# EAGLE schematic OSSI-1 OBC (EAGLE 6.5.0)

## Sheet 1 of 4
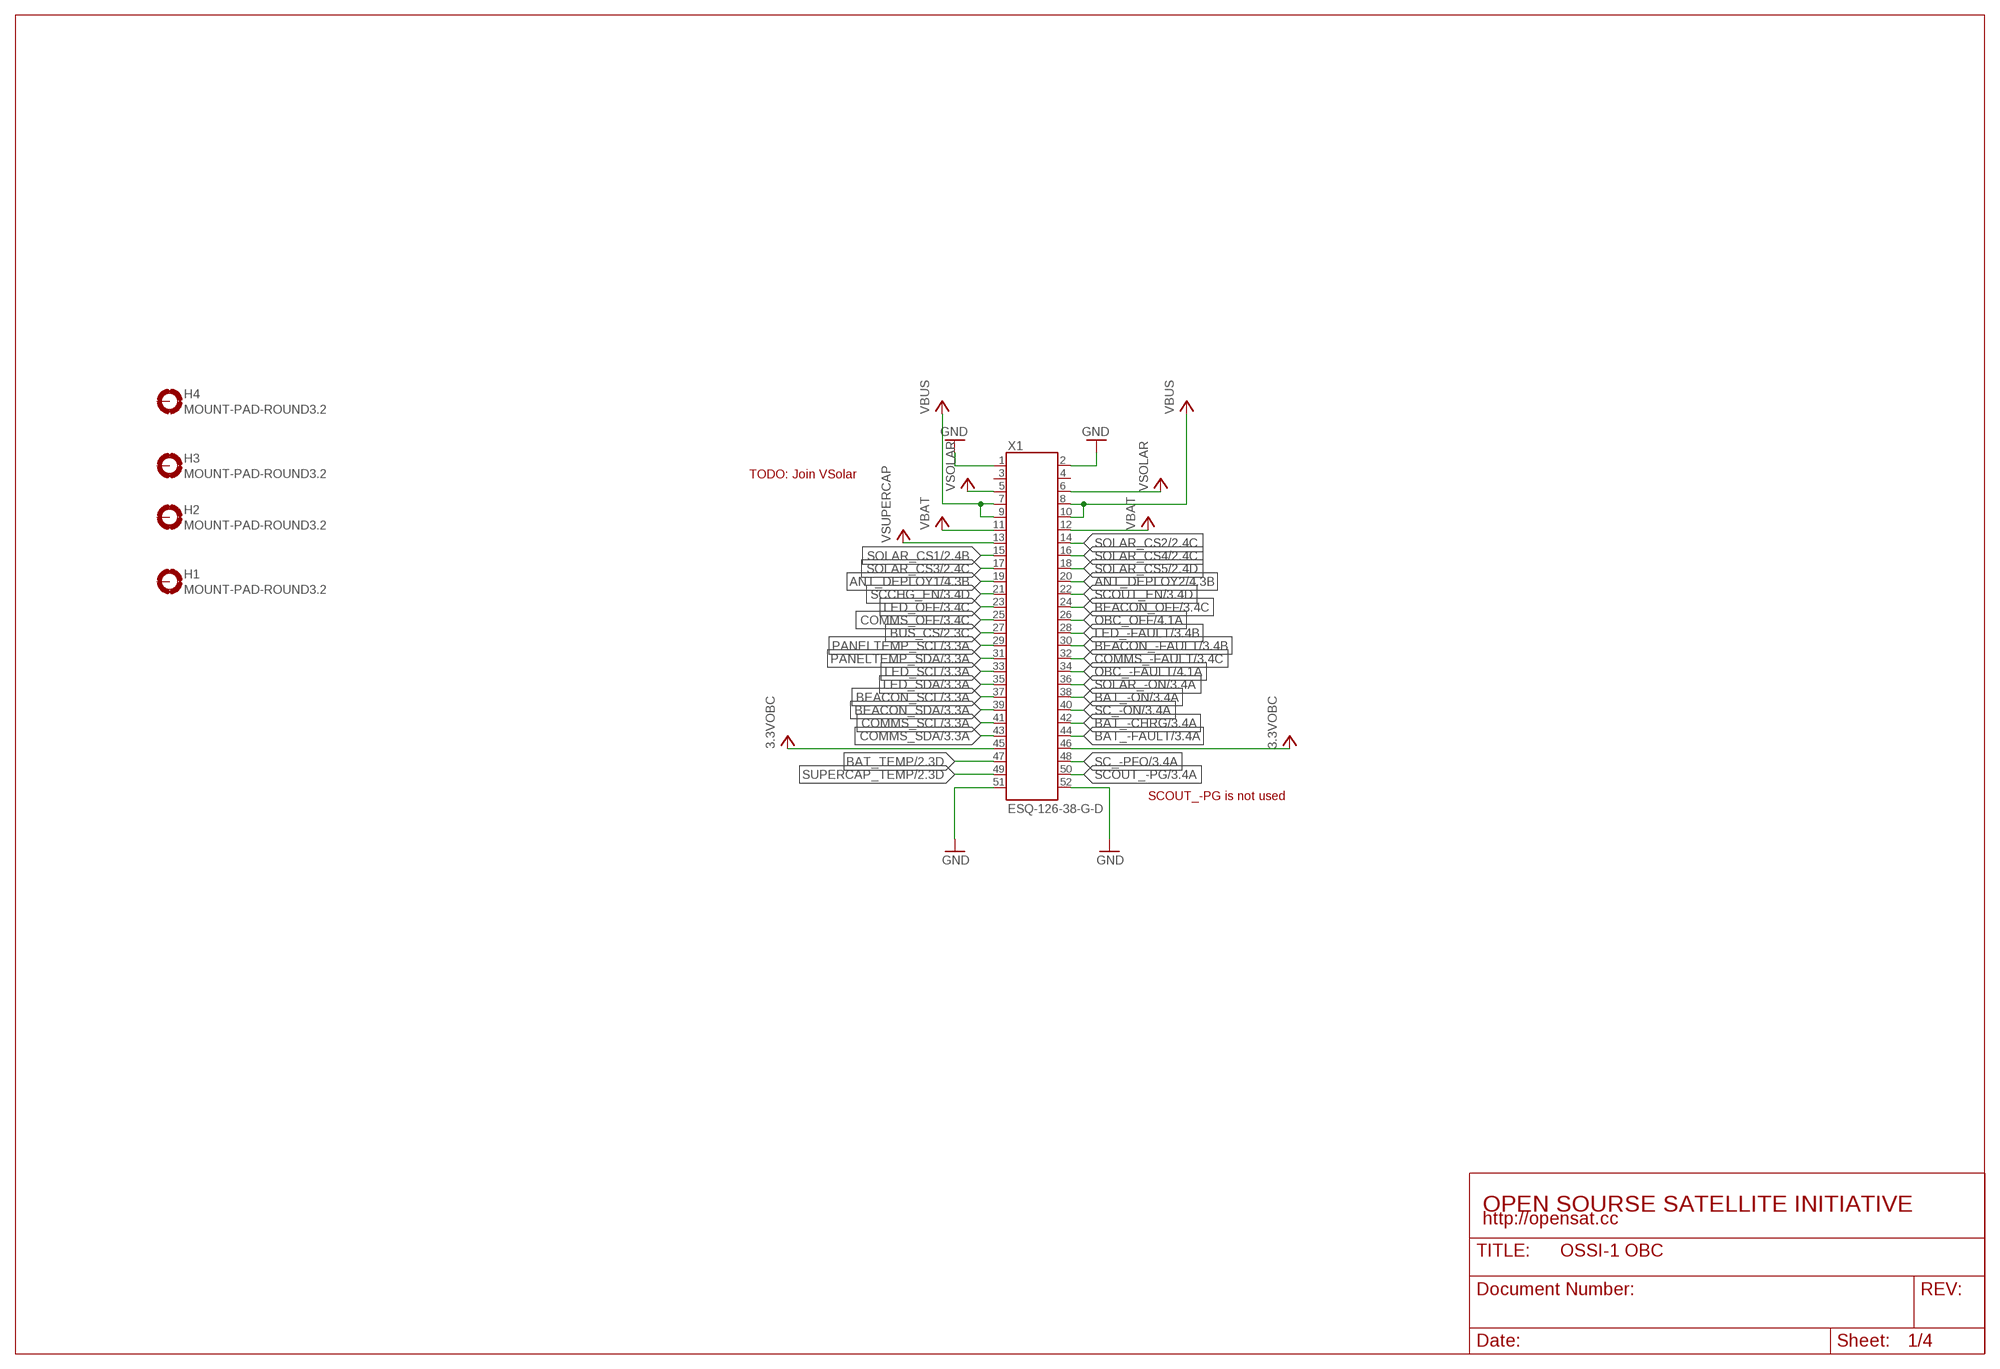
[diagram p0: schematic, sheet 1]

### Parts
H1  MOUNT-PAD-ROUND3.2  [3.2-PAD-ROUND]
H2  MOUNT-PAD-ROUND3.2  [3.2-PAD-ROUND]
H3  MOUNT-PAD-ROUND3.2  [3.2-PAD-ROUND]
H4  MOUNT-PAD-ROUND3.2  [3.2-PAD-ROUND]
X1  ESQ-126-38-G-D  [ESQ-126-XX-X-D]

### Nets
3.3VOBC: X1.45 X1.46 ; also sheet 2,3,4
ANT_DEPLOY1: X1.19 ; also sheet 4
ANT_DEPLOY2: X1.20 ; also sheet 4
BAT_-CHRG: X1.42 ; also sheet 3
BAT_-FAULT: X1.44 ; also sheet 3
BAT_-ON: X1.38 ; also sheet 3
BAT_TEMP: X1.47 ; also sheet 2
BEACON_-FAULT: X1.30 ; also sheet 3
BEACON_OFF: X1.24 ; also sheet 3
BEACON_SCL: X1.37 ; also sheet 3
BEACON_SDA: X1.39 ; also sheet 3
BUS_CS: X1.27 ; also sheet 2
COMMS_-FAULT: X1.32 ; also sheet 3
COMMS_OFF: X1.25 ; also sheet 3
COMMS_SCL: X1.41 ; also sheet 3
COMMS_SDA: X1.43 ; also sheet 3
GND: X1.1 X1.2 X1.51 X1.52 ; also sheet 2,3,4
LED_-FAULT: X1.28 ; also sheet 3
LED_OFF: X1.23 ; also sheet 3
LED_SCL: X1.33 ; also sheet 3
LED_SDA: X1.35 ; also sheet 3
OBC_-FAULT: X1.34 ; also sheet 4
OBC_OFF: X1.26 ; also sheet 4
PANELTEMP_SCL: X1.29 ; also sheet 3
PANELTEMP_SDA: X1.31 ; also sheet 3
SC_-ON: X1.40 ; also sheet 3
SC_-PFO: X1.48 ; also sheet 3
SCCHG_EN: X1.21 ; also sheet 3
SCOUT_-PG: X1.50 ; also sheet 3
SCOUT_EN: X1.22 ; also sheet 3
SOLAR_-ON: X1.36 ; also sheet 3
SOLAR_CS1: X1.15 ; also sheet 2
SOLAR_CS2: X1.14 ; also sheet 2
SOLAR_CS3: X1.17 ; also sheet 2
SOLAR_CS4: X1.16 ; also sheet 2
SOLAR_CS5: X1.18 ; also sheet 2
SUPERCAP_TEMP: X1.49 ; also sheet 2
VBAT: X1.11 X1.12 ; also sheet 2
VBUS: X1.7 X1.8 X1.9 X1.10 ; also sheet 2,3,4
VSOLAR: X1.5 X1.6 ; also sheet 2,3
VSUPERCAP: X1.13 ; also sheet 2
Unconnected: H1.B3,2(MOUNT) H2.B3,2(MOUNT) H3.B3,2(MOUNT) H4.B3,2(MOUNT) X1.3 X1.4

### Notes on the sheet
- TODO: Join VSolar
- SCOUT_-PG is not used
- OPEN SOURSE SATELLITE INITIATIVE
- http://opensat.cc

## Sheet 2 of 4
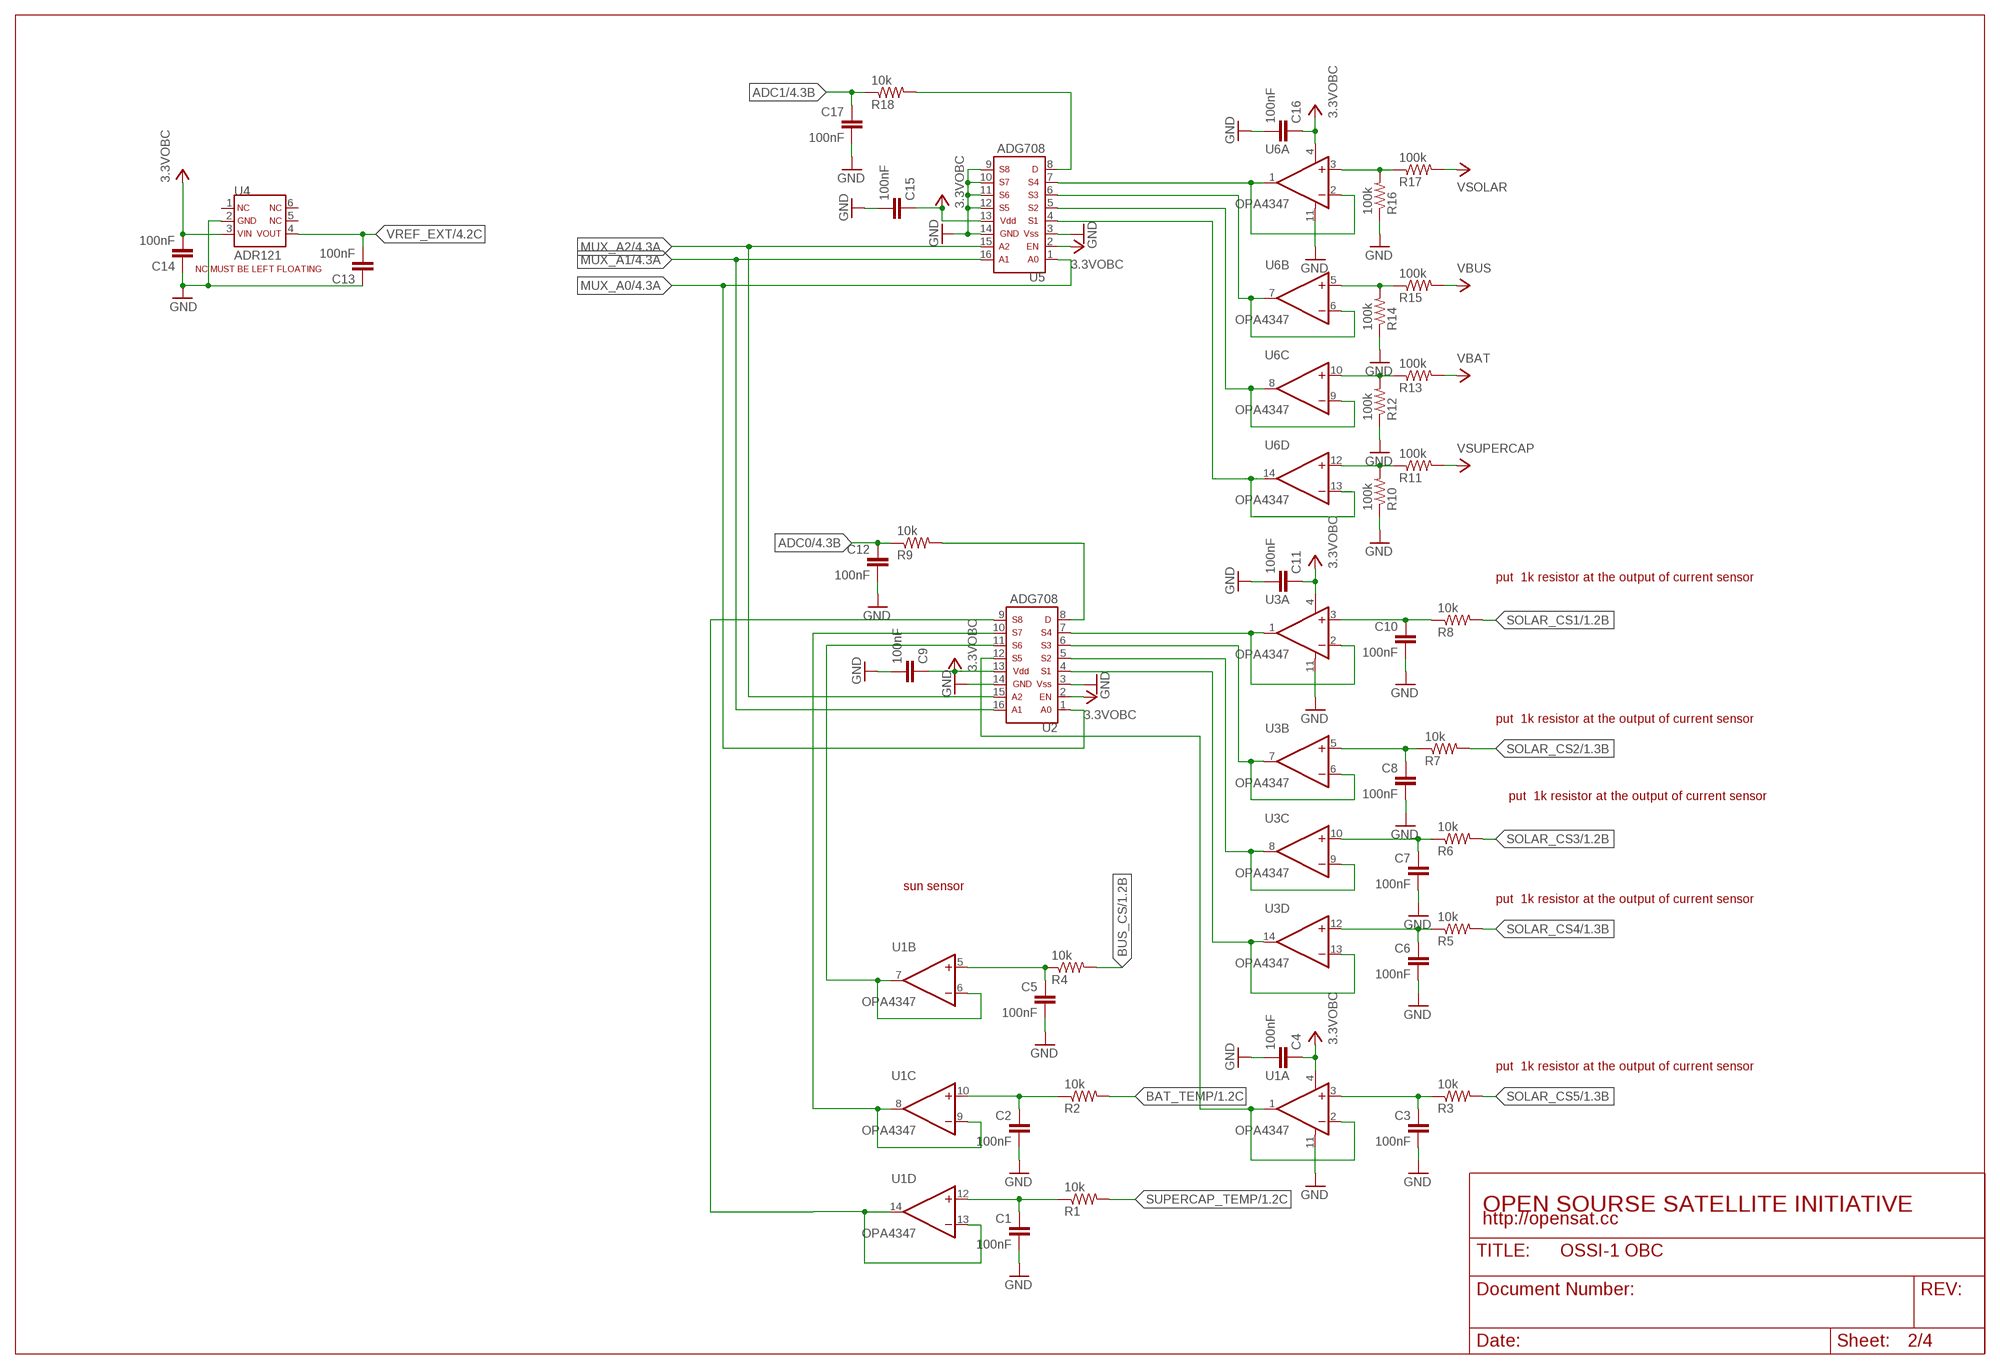
[diagram p1: schematic, sheet 2]

### Parts
C1  100nF  C0603(1608)  [C0603(1608)]
C2  100nF  C0603(1608)  [C0603(1608)]
C3  100nF  C0603(1608)  [C0603(1608)]
C4  100nF  C0603(1608)  [C0603(1608)]
C5  100nF  C0603(1608)  [C0603(1608)]
C6  100nF  C0603(1608)  [C0603(1608)]
C7  100nF  C0603(1608)  [C0603(1608)]
C8  100nF  C0603(1608)  [C0603(1608)]
C9  100nF  C0603(1608)  [C0603(1608)]
C10  100nF  C0603(1608)  [C0603(1608)]
C11  100nF  C0603(1608)  [C0603(1608)]
C12  100nF  C0603(1608)  [C0603(1608)]
C13  100nF  C0603(1608)  [C0603(1608)]
C14  100nF  C0603(1608)  [C0603(1608)]
C15  100nF  C0603(1608)  [C0603(1608)]
C16  100nF  C0603(1608)  [C0603(1608)]
C17  100nF  C0603(1608)  [C0603(1608)]
R1  10k  R0603(1608)  [R0603(1608)]
R2  10k  R0603(1608)  [R0603(1608)]
R3  10k  R0603(1608)  [R0603(1608)]
R4  10k  R0603(1608)  [R0603(1608)]
R5  10k  R0603(1608)  [R0603(1608)]
R6  10k  R0603(1608)  [R0603(1608)]
R7  10k  R0603(1608)  [R0603(1608)]
R8  10k  R0603(1608)  [R0603(1608)]
R9  10k  R0603(1608)  [R0603(1608)]
R10  100k  R0603(1608)  [R0603(1608)]
R11  100k  R0603(1608)  [R0603(1608)]
R12  100k  R0603(1608)  [R0603(1608)]
R13  100k  R0603(1608)  [R0603(1608)]
R14  100k  R0603(1608)  [R0603(1608)]
R15  100k  R0603(1608)  [R0603(1608)]
R16  100k  R0603(1608)  [R0603(1608)]
R17  100k  R0603(1608)  [R0603(1608)]
R18  10k  R0603(1608)  [R0603(1608)]
U1  OPA4347  [TSSOP14-PW]
U2  ADG708  [TSSOP16-RU]
U3  OPA4347  [TSSOP14-PW]
U4  ADR121  ADR127BUJZ-REEL7  [TSOT-6UJ-6]
U5  ADG708  [TSSOP16-RU]
U6  OPA4347  [TSSOP14-PW]

### Nets
3.3VOBC: C4.1 C9.1 C11.1 C14.2 C15.1 C16.1 U1.4(A:V+) U2.2 U2.13 U3.4(A:V+) U4.3 U5.2 U5.13 U6.4(A:V+) ; also sheet 1,3,4
ADC0: C12.1 R9.1 ; also sheet 4
ADC1: C17.1 R18.1 ; also sheet 4
BAT_TEMP: R2.2 ; also sheet 1
BUS_CS: R4.2 ; also sheet 1
GND: C1.2 C2.2 C3.2 C4.2 C5.2 C6.2 C7.2 C8.2 C9.2 C10.2 C11.2 C12.2 C13.1 C14.1 C15.2 C16.2 C17.2 R10.1 R12.1 R14.1 R16.1 U1.11(A:V-) U2.3 U2.14 U3.11(A:V-) U4.2 U5.3 U5.9 U5.10 U5.11 U5.12 U5.14 U6.11(A:V-) ; also sheet 1,3,4
MUX_A0: U2.1 U5.1 ; also sheet 4
MUX_A1: U2.16 U5.16 ; also sheet 4
MUX_A2: U2.15 U5.15 ; also sheet 4
N$2: R16.2 R17.1 U6.3(A:+IN)
N$3: U5.7 U6.1(A:OUT) U6.2(A:-IN)
N$8: U5.6 U6.6(B:-IN) U6.7(B:OUT)
N$9: U5.5 U6.8(C:OUT) U6.9(C:-IN)
N$11: U5.4 U6.13(D:-IN) U6.14(D:OUT)
N$12: U2.7 U3.1(A:OUT) U3.2(A:-IN)
N$21: U2.6 U3.6(B:-IN) U3.7(B:OUT)
N$24: R14.2 R15.1 U6.5(B:+IN)
N$25: R12.2 R13.1 U6.10(C:+IN)
N$26: R10.2 R11.1 U6.12(D:+IN)
N$27: R18.2 U5.8
N$28: U2.5 U3.8(C:OUT) U3.9(C:-IN)
N$29: R9.2 U2.8
N$30: U2.4 U3.13(D:-IN) U3.14(D:OUT)
N$31: U1.1(A:OUT) U1.2(A:-IN) U2.12
N$44: U1.8(C:OUT) U1.9(C:-IN) U2.10
N$45: U1.13(D:-IN) U1.14(D:OUT) U2.9
N$47: C1.1 R1.1 U1.12(D:+IN)
N$48: C2.1 R2.1 U1.10(C:+IN)
N$51: C10.1 R8.1 U3.3(A:+IN)
N$52: C8.1 R7.1 U3.5(B:+IN)
N$53: C7.1 R6.1 U3.10(C:+IN)
N$54: C6.1 R5.1 U3.12(D:+IN)
N$55: C3.1 R3.1 U1.3(A:+IN)
N$58: C5.1 R4.1 U1.5(B:+IN)
SOLAR_CS1: R8.2 ; also sheet 1
SOLAR_CS2: R7.2 ; also sheet 1
SOLAR_CS3: R6.2 ; also sheet 1
SOLAR_CS4: R5.2 ; also sheet 1
SOLAR_CS5: R3.2 ; also sheet 1
SUN_IN: U1.6(B:-IN) U1.7(B:OUT) U2.11
SUPERCAP_TEMP: R1.2 ; also sheet 1
VBAT: R13.2 ; also sheet 1
VBUS: R15.2 ; also sheet 1,3,4
VREF_EXT: C13.2 U4.4 ; also sheet 4
VSOLAR: R17.2 ; also sheet 1,3
VSUPERCAP: R11.2 ; also sheet 1
Unconnected: U4.1 U4.5 U4.6

### Notes on the sheet
- put  1k resistor at the output of current sensor
- put  1k resistor at the output of current sensor
- put  1k resistor at the output of current sensor
- sun sensor
- put  1k resistor at the output of current sensor
- put  1k resistor at the output of current sensor
- OPEN SOURSE SATELLITE INITIATIVE
- http://opensat.cc

## Sheet 3 of 4
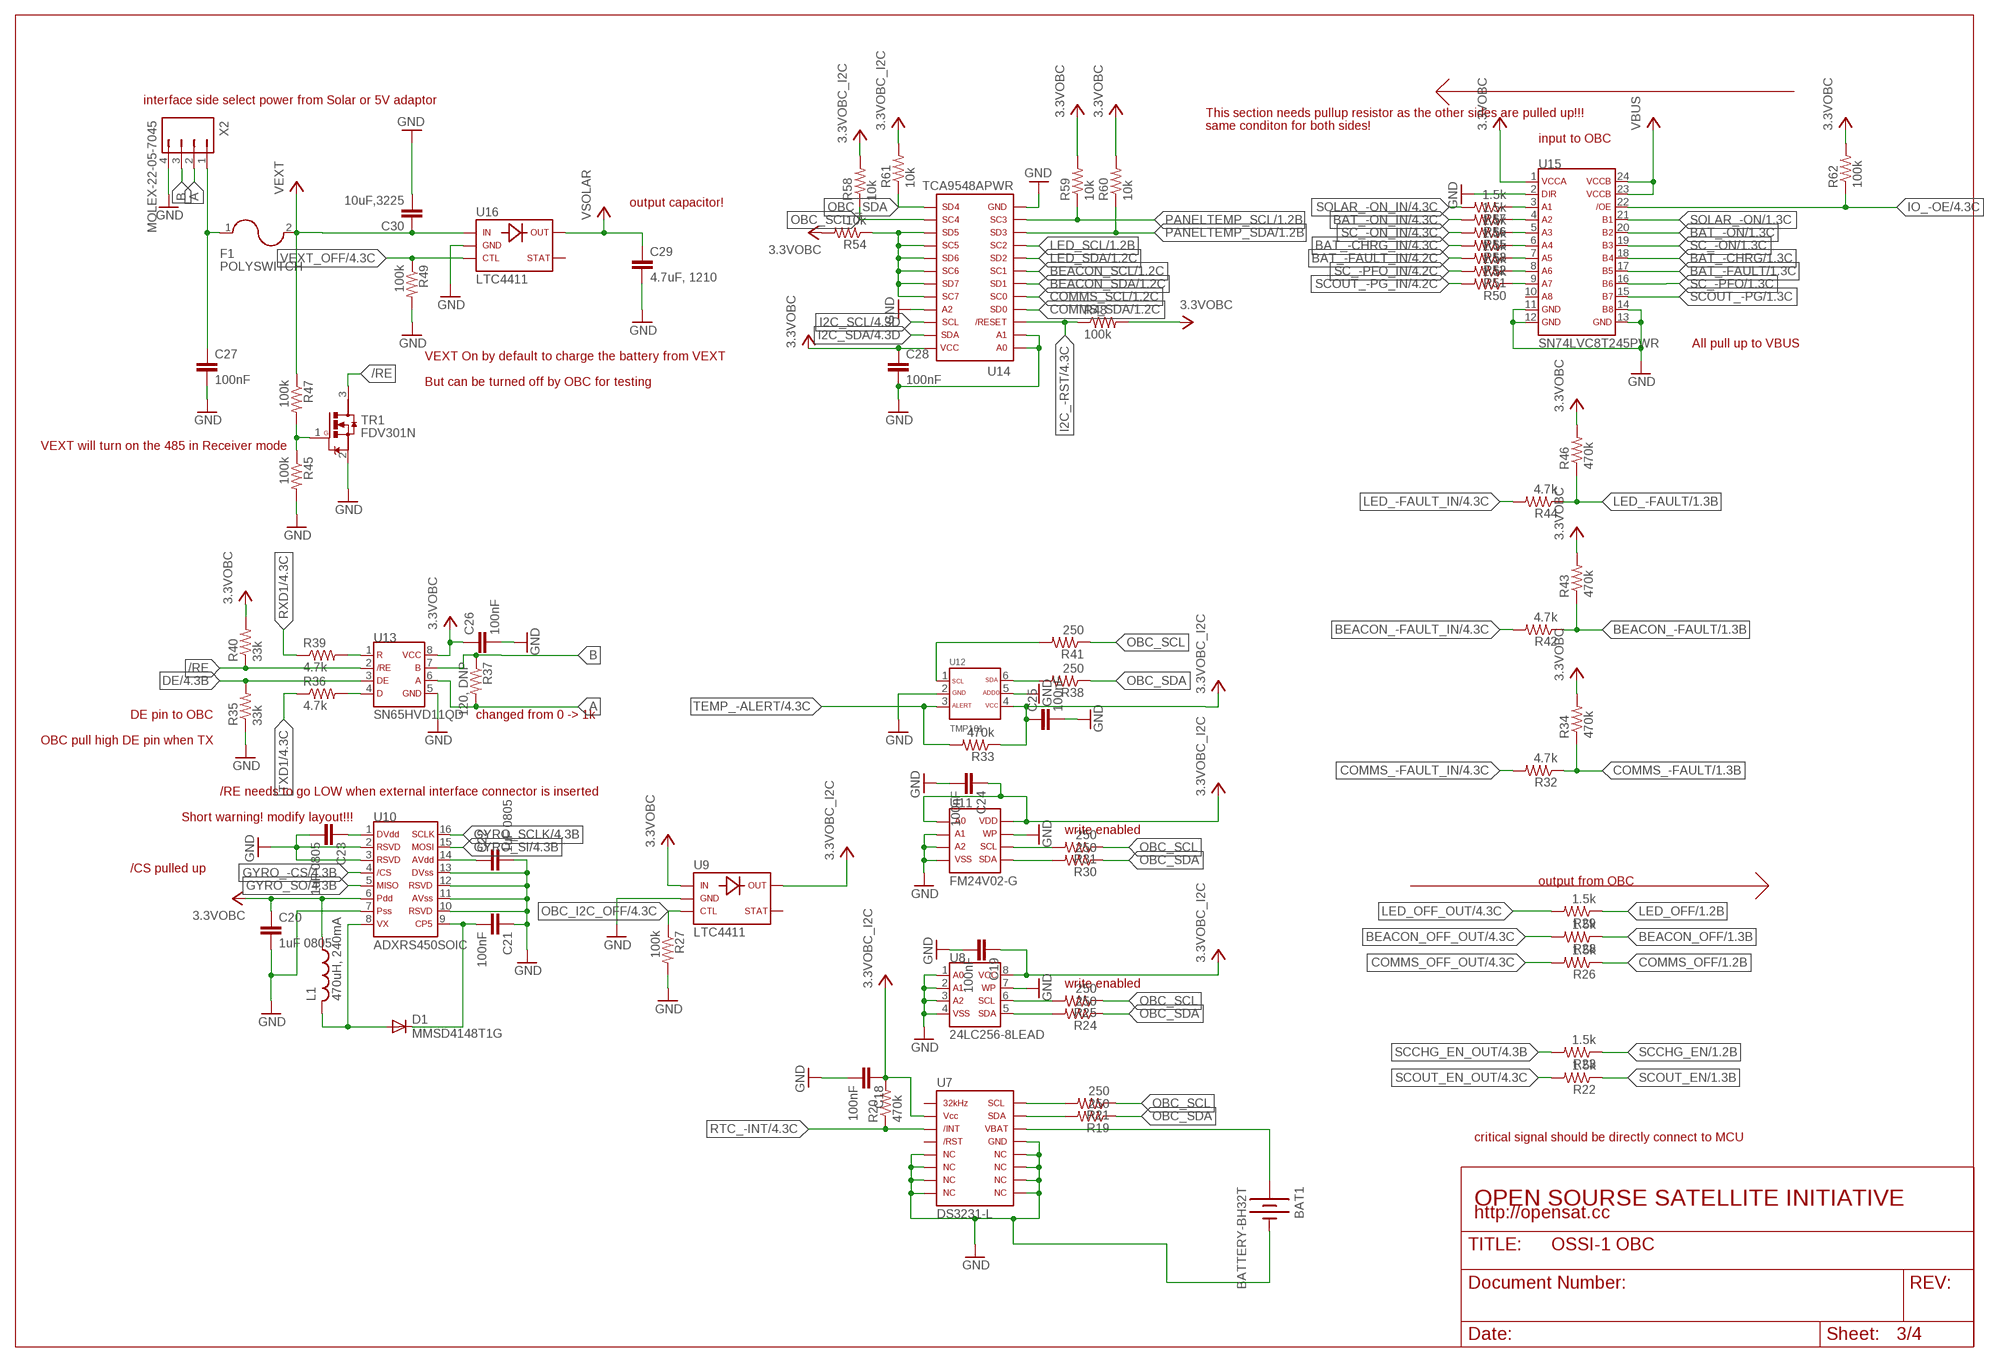
[diagram p2: schematic, sheet 3]

### Parts
BAT1  BATTERY-BH32T  [BH32T-C-G]
C18  100nF  C0603(1608)  [C0603(1608)]
C19  100nF  C0603(1608)  [C0603(1608)]
C20  1uF 0805  C0805(2012)  [C0805(2012)]
C21  100nF  C0603(1608)  [C0603(1608)]
C22  1uF 0805  C0805(2012)  [C0805(2012)]
C23  1uF 0805  C0805(2012)  [C0805(2012)]
C24  100nF  C0603(1608)  [C0603(1608)]
C25  100nF  C0603(1608)  [C0603(1608)]
C26  100nF  C0603(1608)  [C0603(1608)]
C27  100nF  C0603(1608)  [C0603(1608)]
C28  100nF  C0603(1608)  [C0603(1608)]
C29  4.7uF, 1210  C1206(3216)-GCM31  [C1206-GCM31]
C30  10uF,3225  C1210(3225)-GCM32  [C1210-GCM32]
D1  MMSD4148T1G  [SOD-123]
F1  POLYSWITCH  [NANOSMDC150FCT]
L1  470uH, 240mA  LQH55  [L(2220)]
R19  250  R0603(1608)  [R0603(1608)]
R20  470k  R0603(1608)  [R0603(1608)]
R21  250  R0603(1608)  [R0603(1608)]
R22  1.5k  R0603(1608)  [R0603(1608)]
R23  1.5k  R0603(1608)  [R0603(1608)]
R24  250  R0603(1608)  [R0603(1608)]
R25  250  R0603(1608)  [R0603(1608)]
R26  1.5k  R0603(1608)  [R0603(1608)]
R27  100k  R0603(1608)  [R0603(1608)]
R28  1.5k  R0603(1608)  [R0603(1608)]
R29  1.5k  R0603(1608)  [R0603(1608)]
R30  250  R0603(1608)  [R0603(1608)]
R31  250  R0603(1608)  [R0603(1608)]
R32  4.7k  R0603(1608)  [R0603(1608)]
R33  470k  R0603(1608)  [R0603(1608)]
R34  470k  R0603(1608)  [R0603(1608)]
R35  33k  R0603(1608)  [R0603(1608)]
R36  4.7k  R0603(1608)  [R0603(1608)]
R37  120, DNP  R0603(1608)  [R0603(1608)]
R38  250  R0603(1608)  [R0603(1608)]
R39  4.7k  R0603(1608)  [R0603(1608)]
R40  33k  R0603(1608)  [R0603(1608)]
R41  250  R0603(1608)  [R0603(1608)]
R42  4.7k  R0603(1608)  [R0603(1608)]
R43  470k  R0603(1608)  [R0603(1608)]
R44  4.7k  R0603(1608)  [R0603(1608)]
R45  100k  R0603(1608)  [R0603(1608)]
R46  470k  R0603(1608)  [R0603(1608)]
R47  100k  R0603(1608)  [R0603(1608)]
R48  100k  R0603(1608)  [R0603(1608)]
R49  100k  R0603(1608)  [R0603(1608)]
R50  1.5k  R0603(1608)  [R0603(1608)]
R51  1.5k  R0603(1608)  [R0603(1608)]
R52  1.5k  R0603(1608)  [R0603(1608)]
R53  1.5k  R0603(1608)  [R0603(1608)]
R54  10k  R0603(1608)  [R0603(1608)]
R55  1.5k  R0603(1608)  [R0603(1608)]
R56  1.5k  R0603(1608)  [R0603(1608)]
R57  1.5k  R0603(1608)  [R0603(1608)]
R58  10k  R0603(1608)  [R0603(1608)]
R59  10k  R0603(1608)  [R0603(1608)]
R60  10k  R0603(1608)  [R0603(1608)]
R61  10k  R0603(1608)  [R0603(1608)]
R62  100k  R0603(1608)  [R0603(1608)]
TR1  FDV301N  [SOT23]
U7  DS3231-L  [SO16L]
U8  24LC256-8LEAD  [SO08-208]
U9  LTC4411  [TSOT23-5]
U10  ADXRS450SOIC  [SOIC-16CAV]
U11  FM24V02-G  [SO8]
U12  TMP101  [SOT23-6DBV]
U13  SN65HVD11QD  [SO8]
U14  TCA9548APWR  PCA9548APWR  [TSSOP-24-PW]
U15  SN74LVC8T245PWR  [PW_R-PDSO-G24]
U16  LTC4411  [TSOT23-5]
X2  MOLEX-22-05-7045  [22-05-7045]

### Nets
3.3VOBC: C20.1 C26.1 C28.1 L1.P$1 R34.2 R40.2 R43.2 R46.2 R48.2 R54.2 R59.2 R60.2 R62.2 U9.P$1 U10.6 U13.8 U14.24 U15.1 ; also sheet 1,2,4
3.3VOBC_I2C: C18.1 C19.1 C24.1 C25.1 R20.2 R33.1 R58.2 R61.2 U7.2 U8.8 U9.P$5 U11.1(A0) U11.8(VDD) U12.4
/RE: R40.1 TR1.3(D) U13.2
A: R37.2 U13.6 X2.2
B: R37.1 U13.7 X2.3
BAT_-CHRG: U15.18 ; also sheet 1
BAT_-CHRG_IN: R53.2 ; also sheet 4
BAT_-FAULT: U15.17 ; also sheet 1
BAT_-FAULT_IN: R52.2 ; also sheet 4
BAT_-ON: U15.20 ; also sheet 1
BAT_-ON_IN: R56.2 ; also sheet 4
BEACON_-FAULT: R42.1 R43.1 ; also sheet 1
BEACON_-FAULT_IN: R42.2 ; also sheet 4
BEACON_OFF: R28.1 ; also sheet 1
BEACON_OFF_OUT: R28.2 ; also sheet 4
BEACON_SCL: U14.7 ; also sheet 1
BEACON_SDA: U14.6 ; also sheet 1
COMMS_-FAULT: R32.1 R34.1 ; also sheet 1
COMMS_-FAULT_IN: R32.2 ; also sheet 4
COMMS_OFF: R26.1 ; also sheet 1
COMMS_OFF_OUT: R26.2 ; also sheet 4
COMMS_SCL: U14.5 ; also sheet 1
COMMS_SDA: U14.4 ; also sheet 1
DE: R35.2 U13.3 ; also sheet 4
GND: BAT1.N(-) C18.2 C19.2 C20.2 C21.1 C22.2 C23.2 C24.2 C25.2 C26.2 C27.2 C28.2 C29.P$2 C30.P$2 R27.2 R35.1 R45.2 R49.2 TR1.2(S) U7.5 U7.6 U7.7 U7.8 U7.9 U7.10 U7.11 U7.12 U7.13 U8.1 U8.2 U8.3 U8.4 U8.7 U9.P$2 U10.2 U10.3 U10.7 U10.10 U10.11 U10.12 U10.13 U11.2(A1) U11.3(A2) U11.4(VSS) U11.7(WP) U12.2 U12.5 U13.5 U14.1 U14.2 U14.12 U14.21 U15.2 U15.11 U15.12 U15.13 U15.14 U16.P$2 X2.4 ; also sheet 1,2,4
GYRO_-CS: U10.4 ; also sheet 4
GYRO_SCLK: U10.16 ; also sheet 4
GYRO_SI: U10.15 ; also sheet 4
GYRO_SO: U10.5 ; also sheet 4
I2C_-RST: R48.1 U14.3 ; also sheet 4
I2C_SCL: U14.22 ; also sheet 4
I2C_SDA: U14.23 ; also sheet 4
IO_-OE: R62.1 U15.22 ; also sheet 4
LED_-FAULT: R44.1 R46.1 ; also sheet 1
LED_-FAULT_IN: R44.2 ; also sheet 4
LED_OFF: R29.1 ; also sheet 1
LED_OFF_OUT: R29.2 ; also sheet 4
LED_SCL: U14.9 ; also sheet 1
LED_SDA: U14.8 ; also sheet 1
N$4: R45.1 R47.2 TR1.1(G)
N$7: R19.2 U7.15
N$14: R39.2 U13.1
N$15: R21.2 U7.16
N$16: R54.1 U14.15 U14.16 U14.17 U14.18 U14.19 U14.20
N$22: R36.2 U13.4
N$33: C23.1 U10.1
N$34: R24.2 U8.5
N$35: R25.2 U8.6
N$36: R30.2 U11.5(SDA)
N$39: R31.2 U11.6(SCL)
N$40: R38.2 U12.6
N$41: R41.2 U12.1
N$43: C27.1 F1.1 X2.1
N$46: C22.1 U10.14
N$49: R53.1 U15.6
N$50: R52.1 U15.7
N$56: R51.1 U15.8
N$57: R50.1 U15.9
N$65: BAT1.P(+) U7.14
N$70: R55.1 U15.5
N$71: R56.1 U15.4
N$72: R57.1 U15.3
N$82: D1.A L1.P$2 U10.8
N$90: C21.2 D1.C U10.9
OBC_I2C_OFF: R27.1 U9.P$3 ; also sheet 4
OBC_SCL: R21.1 R25.1 R31.1 R41.1 R58.1 U14.14
OBC_SDA: R19.1 R24.1 R30.1 R38.1 R61.1 U14.13
PANELTEMP_SCL: R59.1 U14.11 ; also sheet 1
PANELTEMP_SDA: R60.1 U14.10 ; also sheet 1
RTC_-INT: R20.1 U7.3 ; also sheet 4
RXD1: R39.1 ; also sheet 4
SC_-ON: U15.19 ; also sheet 1
SC_-ON_IN: R55.2 ; also sheet 4
SC_-PFO: U15.16 ; also sheet 1
SC_-PFO_IN: R51.2 ; also sheet 4
SCCHG_EN: R23.1 ; also sheet 1
SCCHG_EN_OUT: R23.2 ; also sheet 4
SCOUT_-PG: U15.15 ; also sheet 1
SCOUT_-PG_IN: R50.2 ; also sheet 4
SCOUT_EN: R22.1 ; also sheet 1
SCOUT_EN_OUT: R22.2 ; also sheet 4
SOLAR_-ON: U15.21 ; also sheet 1
SOLAR_-ON_IN: R57.2 ; also sheet 4
TEMP_-ALERT: R33.2 U12.3 ; also sheet 4
TXD1: R36.1 ; also sheet 4
VBUS: U15.23 U15.24 ; also sheet 1,2,4
VEXT: C30.P$1 F1.2 R47.1 U16.P$1
VEXT_OFF: R49.1 U16.P$3 ; also sheet 4
VSOLAR: C29.P$1 U16.P$5 ; also sheet 1,2
Unconnected: U7.1 U7.4 U9.P$4 U15.10 U16.P$4

### Notes on the sheet
- interface side select power from Solar or 5V adaptor
- This section needs pullup resistor as the other sides are pulled up!!!
- same conditon for both sides!
- input to OBC
- output capacitor!
- All pull up to VBUS
- VEXT On by default to charge the battery from VEXT
- But can be turned off by OBC for testing
- VEXT will turn on the 485 in Receiver mode
- DE pin to OBC | changed from 0 -> 1k
- OBC pull high DE pin when TX
- /RE needs to go LOW when external interface connector is inserted
- Short warning! modify layout!!!
- write enabled
- /CS pulled up
- output from OBC
- write enabled
- critical signal should be directly connect to MCU
- OPEN SOURSE SATELLITE INITIATIVE
- http://opensat.cc

## Sheet 4 of 4
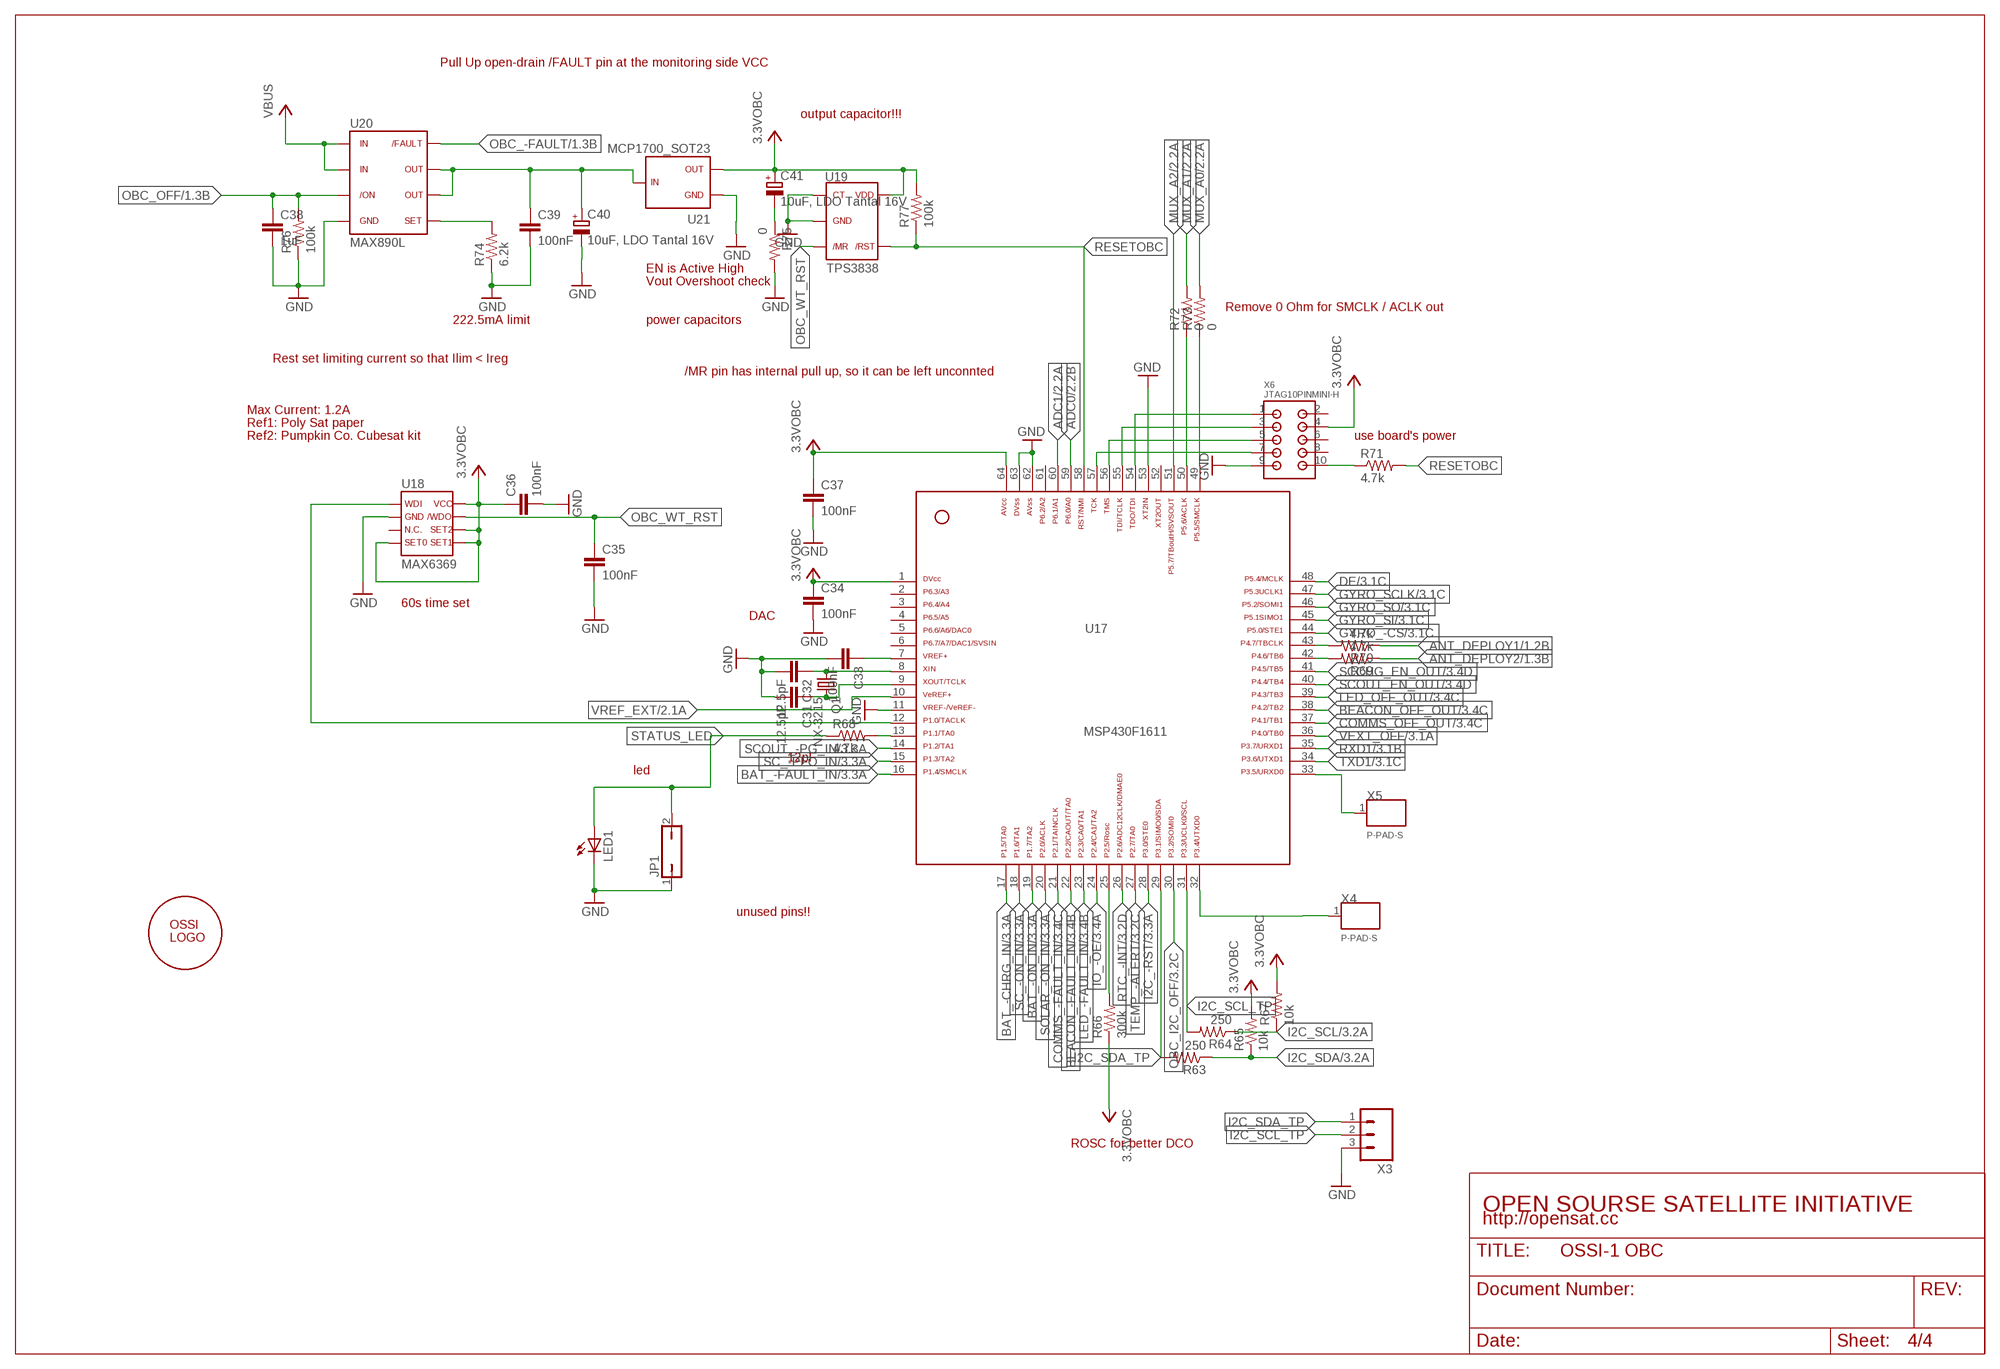
[diagram p3: schematic, sheet 4]

### Parts
C31  12.5pF  C0603(1608)  [C0603(1608)]
C32  12.5pF  C0603(1608)  [C0603(1608)]
C33  100nF  C0603(1608)  [C0603(1608)]
C34  100nF  C0603(1608)  [C0603(1608)]
C35  100nF  C0603(1608)  [C0603(1608)]
C36  100nF  C0603(1608)  [C0603(1608)]
C37  100nF  C0603(1608)  [C0603(1608)]
C38  1uF  C0603(1608)  [C0603(1608)]
C39  100nF  C0603(1608)  [C0603(1608)]
C40  10uF, LDO Tantal 16V  C-TANTAL-A  [C1206(3216)-A]
C41  10uF, LDO Tantal 16V  C-TANTAL-A  [C1206(3216)-A]
JP1  JP1Q  [JP1]
LED1  LED0603  [LED-0603]
Q1  NX-3215  [NX-3215]
R63  250  R0603(1608)  [R0603(1608)]
R64  250  R0603(1608)  [R0603(1608)]
R65  10k  R0603(1608)  [R0603(1608)]
R66  300k  R0603(1608)  [R0603(1608)]
R67  10k  R0603(1608)  [R0603(1608)]
R68  4.7k  R0603(1608)  [R0603(1608)]
R69  4.7k  R0603(1608)  [R0603(1608)]
R70  4.7k  R0603(1608)  [R0603(1608)]
R71  4.7k  R0603(1608)  [R0603(1608)]
R72  0  R0603(1608)  [R0603(1608)]
R73  0  R0603(1608)  [R0603(1608)]
R74  6.2k  R0603(1608)  [R0603(1608)]
R75  0  R0603(1608)  [R0603(1608)]
R76  100k  R0603(1608)  [R0603(1608)]
R77  100k  R0603(1608)  [R0603(1608)]
U17  MSP430F1611  [PM/PAG64]
U18  MAX6369  [SOT23-8]
U19  TPS3838  [SOT23-5DBV]
U20  MAX890L  [SO8]
U21  MCP1700_SOT23  [SOT23]
U$1  OSSILOGORECT  [OSSILOGORECT1005]
X3  M03PTH  [1X03]
X4  P-PAD-S  [P-PAD-S]
X5  P-PAD-S  [P-PAD-S]
X6  JTAG10PINMINI-H  [M50-3200545]

### Nets
3.3VOBC: C34.1 C36.1 C37.1 C41.1(+) R65.2 R66.1 R67.2 R77.2 U17.1 U17.64 U18.4 U18.5 U18.6 U18.8 U19.5 U21.2 X6.4 ; also sheet 1,2,3
ADC0: U17.59 ; also sheet 2
ADC1: U17.60 ; also sheet 2
ANT_DEPLOY1: R70.1 ; also sheet 1
ANT_DEPLOY2: R69.1 ; also sheet 1
BAT_-CHRG_IN: U17.17 ; also sheet 3
BAT_-FAULT_IN: U17.16 ; also sheet 3
BAT_-ON_IN: U17.19 ; also sheet 3
BEACON_-FAULT_IN: U17.22 ; also sheet 3
BEACON_OFF_OUT: U17.38 ; also sheet 3
COMMS_-FAULT_IN: U17.21 ; also sheet 3
COMMS_OFF_OUT: U17.37 ; also sheet 3
DE: U17.48 ; also sheet 3
GND: C31.2 C32.2 C33.2 C34.2 C35.2 C36.2 C37.2 C38.2 C39.2 C40.2(-) JP1.1 LED1.C R74.1 R75.2 R76.1 U17.11 U17.53 U17.62 U17.63 U18.2 U19.1 U19.2 U20.4 U21.1 X3.3 X6.9 ; also sheet 1,2,3
GYRO_-CS: U17.44 ; also sheet 3
GYRO_SCLK: U17.47 ; also sheet 3
GYRO_SI: U17.45 ; also sheet 3
GYRO_SO: U17.46 ; also sheet 3
I2C_-RST: U17.28 ; also sheet 3
I2C_SCL: R64.1 R67.1 ; also sheet 3
I2C_SCL_TP: R64.2 U17.31 X3.2
I2C_SDA: R63.1 R65.1 ; also sheet 3
I2C_SDA_TP: R63.2 U17.29 X3.1
IO_-OE: U17.24 ; also sheet 3
LED_-FAULT_IN: U17.23 ; also sheet 3
LED_OFF_OUT: U17.39 ; also sheet 3
MUX_A0: R73.2 ; also sheet 2
MUX_A1: R72.2 ; also sheet 2
MUX_A2: U17.51 ; also sheet 2
N$1: U17.12 U18.1
N$5: C32.1 Q1.1 U17.8
N$6: C31.1 Q1.2 U17.9
N$10: R74.2 U20.5
N$13: C33.1 U17.7
N$17: U17.57 X6.7
N$18: U17.56 X6.5
N$19: U17.55 X6.3
N$20: U17.54 X6.1
N$23: R71.1 X6.10
N$32: R68.2 U17.13
N$37: R70.2 U17.43
N$38: R69.2 U17.42
N$42: R66.2 U17.25
N$59: C41.2(-) R75.1
N$60: U17.33 X5.1
N$61: U17.32 X4.1
N$62: R73.1 U17.49
N$64: R72.1 U17.50
N$666: C39.1 C40.1(+) U20.6 U20.7 U21.3
OBC_-FAULT: U20.8 ; also sheet 1
OBC_I2C_OFF: U17.30 ; also sheet 3
OBC_OFF: C38.1 R76.2 U20.3 ; also sheet 1
OBC_WT_RST: C35.1 U18.7 U19.3
RESETOBC: R71.2 R77.1 U17.58 U19.4
RTC_-INT: U17.26 ; also sheet 3
RXD1: U17.35 ; also sheet 3
SC_-ON_IN: U17.18 ; also sheet 3
SC_-PFO_IN: U17.15 ; also sheet 3
SCCHG_EN_OUT: U17.41 ; also sheet 3
SCOUT_-PG_IN: U17.14 ; also sheet 3
SCOUT_EN_OUT: U17.40 ; also sheet 3
SOLAR_-ON_IN: U17.20 ; also sheet 3
STATUS_LED: JP1.2 LED1.A R68.1
TEMP_-ALERT: U17.27 ; also sheet 3
TXD1: U17.34 ; also sheet 3
VBUS: U20.1 U20.2 ; also sheet 1,2,3
VEXT_OFF: U17.36 ; also sheet 3
VREF_EXT: U17.10 ; also sheet 2
Unconnected: U17.2 U17.3 U17.4 U17.5 U17.6 U17.52 U17.61 U18.3 X6.2 X6.6 X6.8

### Notes on the sheet
- Pull Up open-drain /FAULT pin at the monitoring side VCC
- output capacitor!!!
- EN is Active High
- Vout Overshoot check
- Remove 0 Ohm for SMCLK / ACLK out
- 222.5mA limit | power capacitors
- Rest set limiting current so that Ilim < Ireg
- /MR pin has internal pull up, so it can be left unconnted
- Max Current: 1.2A
- Ref1: Poly Sat paper
- Ref2: Pumpkin Co. Cubesat kit | use board's power
- 60s time set
- DAC
- 12pF
- led
- unused pins!!
- ROSC for better DCO
- OPEN SOURSE SATELLITE INITIATIVE
- http://opensat.cc

## Library data of the parts
BAT1 = OSSI:BATTERY
C1-C39 = OSSI:C
C40 C41 = OSSI:C-TANTAL-A: TAJA105M020RNJ Tantal Capacitor Manufacturer: AVX 1206(3126) Ref: www.avx.com/docs/techinfo/tantappl.pdf
D1 = OSSI:MMSD4148T1G
F1 = OSSI:POLYSWITCH: Resettable Polyswitch
H1-H4 = OSSI:MOUNT-PAD-ROUND
JP1 = OSSI:JP1Q: JUMPER
L1 = OSSI:L
LED1 = SparkFun:LED: LEDs Standard schematic elements and footprints for 5mm, 3mm, 1206, and 0603 sized LEDs. 5mm - Spark Fun Electronics SKU : COM-00529 (and others)
Q1 = OSSI:NX-3215: NDK 32.768 kHz SMD Crystal P/N: NX3215SA-32.768K-STD-MUA-9 Nominal frequency (kHz): 32.768 Package Size (L×W×H : mm): 3.2×1.5×0.8 Operating Temperature Range(*1) / Storage Temperature Range (°C): -40 to +85 / -40 to +85 Level of drive: 0.1µW (Max. 0.5µW) Frequency Tolerance (25±3°C): ±20×10-6 Load Capacitance: 9.0pF, 12.5pF Equivalent Series Resistance: 70kΩ Max. Ordering Code: NX3215SA-32.768K-STD-MUA-9 (Load Capacitance9.0pF) /NX3215SA-32.768K-STD-MUA-8 (Load Capacitance12.5pF)
R1-R77 = OSSI:R
TR1 = OSSI:FDV301N: FDV301N Digital N channel - FET / Rdson = 5 Ohm / Vgs = 0.7~1.06V / Ids = 220mA
U1 U3 U6 = OSSI:OPA4347: OPA4347 RAIL-TO-RAIL INPUT AND OUTPUT SINGLE SUPPLY: 2.3V to 5.5V LOW IQ: 20µ
U2 U5 = OSSI:ADG70*
U4 = OSSI:ADR127: ADR127 Precision, Micropower LDO Voltage References in TSOT ADR127BUJZ-REEL7
U7 = OSSI:DS3231: DS3231 Extremely Accureate I2C integrated RTC/TCXO/Crystal by MAXIM
U8 = OSSI:24LC256: 24LC256 256K I2C™ CMOS Serial EEPROM
U9 U16 = OSSI:LTC4411: Linear Techonology LTC4411 ideal diode Small Regulated Forward Voltage (28mV) 2.6A Maximum Forward Current 2.6V to 5.5V Operating Range MOSFET based
U10 = OSSI:ADXRS450SOIC
U11 = OSSI:FM24V02: FM24V02 256Kb Serial 3V F-RAM Memory by RAMTRON
U12 = OSSI:TMP101: TMP101 Digital Temerature Sensor with I2C Interface from Texas Instruments with Alert Function
U13 = OSSI:SN65HVD11: SN65HVD11 3.3V RS485 Transceiver QD: -40~+125
U14 = OSSI:PCA9548APWR: PCA9548APWR 8-Channel I2C Switch With Reset 1-of-8 Bidirectional Translating Switches Address by Three Hardware Address Pins for Use of up to Eight Devices Operating Power: 2.3 V to 5.5 V Active-Low Reset Input
U15 = OSSI:SN74LVC8T245: SN74LVC8T245 8-BIT DUAL-SUPPLY BUS TRANSCEIVER WITH CONFIGURABLE VOLTAGE TRANSLATION AND 3-STATE OUTPUTS
U17 = OSSI:MSP430F1611: MSP430F1611
U18 = OSSI:MAX6369: MAX6369 Pin-Selectable Watchdog Timers Max 6369 is Open-drain output 1 ms to 60 s seletable timeout
U19 = OSSI:TPS3838: TPS3838 NanoPower Supervisory IC from texas instruments. TPS3838 is open-drain output
U20 = OSSI:MAX890L: MAX 890L 1.2A, Current-Limited, High-Side P-Channel Switch with Thermal Shutdown BY MAXIM
U21 = OSSI:MCP1700: MCP1700 LDO from Microchips
U$1 = OSSI:OSSILOGO
X1 = OSSI:ESQ-126-: Samtec ESQ-126-XX-G-D Elevated Sockets Seires ESQ-126-37-G-D ESQ-126-38-G-D ESQ-126-39-G-D
X2 = OSSI:MOLEX-22-05-7045: molex spoxt 5268 series 22-05-7045 for external interface
X3 = OSSI:M03: Header 3 Standard 3-pin 0.1" header. Use with straight break away headers (SKU : PRT-00116), right angle break away headers (PRT-00553), swiss pins (PRT-00743), machine pins (PRT-00117), and female headers (PRT-00115). Molex polarized connector foot print use with SKU : PRT-08232 with associated crimp pins and housings.
X4 X5 = OSSI:P-PAD
X6 = OSSI:JTAG10PINMINI